# Altium project SINDiB_MM.PrjPcb (part 1 of 2)
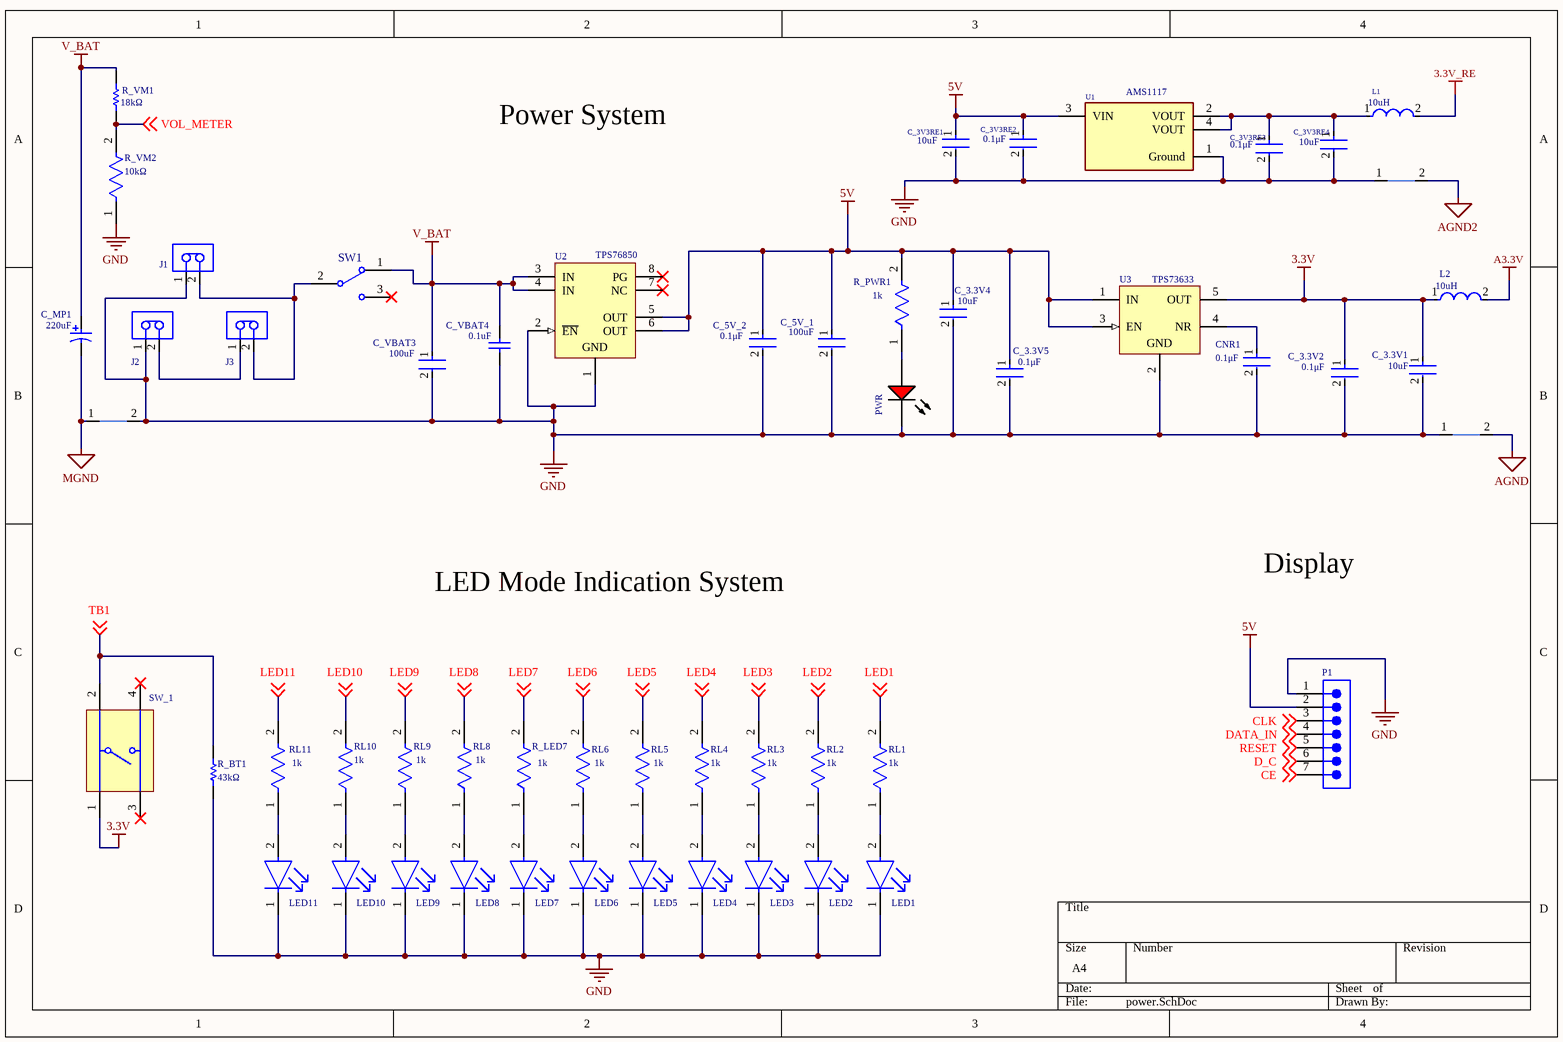
[diagram p0: power.SchDoc]
4 sheets, 150 parts. Net scope: global (net labels, ports and power ports of the same name join across sheets).
Board file: main_MM.PcbDoc
Sheets:
  power.SchDoc
  sensors.SchDoc
  main_controller.SchDoc
  motor.SchDoc

## Sheet power.SchDoc
size A4; SheetNumber: 1; SheetTotal: 4

### Parts
C_3.3V1  value 10uF  [FP-C0805C-DG-MFG]  (hidden comment: C0805C106K8PACTU)
C_3.3V2  value 0.1μF  [FP-C0805C-DN-MFG]  (hidden comment: C0805C104J8RACTU)
C_3.3V4  value 10uF  [FP-C0805C-DG-MFG]  (hidden comment: C0805C106K8PACTU)
C_3.3V5  value 0.1μF  [FP-C0805C-DN-MFG]  (hidden comment: C0805C104J8RACTU)
C_3V3RE1  value 10uF  [FP-C0805C-DG-MFG]  (hidden comment: C0805C106K8PACTU)
C_3V3RE2  value 0.1μF  [FP-C0805C-DN-MFG]  (hidden comment: C0805C104J8RACTU)
C_3V3RE3  value 0.1μF  [FP-C0805C-DN-MFG]  (hidden comment: C0805C104J8RACTU)
C_3V3RE4  value 10uF  [FP-C0805C-DG-MFG]  (hidden comment: C0805C106K8PACTU)
C_5V_1  value 100uF  [FP-C1206C-EH-MFG]  (hidden comment: C1206C107M9PACTU)
C_5V_2  value 0.1μF  [FP-C0805C-DN-MFG]  (hidden comment: C0805C104J8RACTU)
C_MP1  value 220uF  [NIC-CAPA2-6.3X7.7_V]  (hidden comment: UUD1A221MCL1GS)
C_VBAT3  value 100uF  [FP-C1206C-EH-MFG]  (hidden comment: C1206C107M9PACTU)
C_VBAT4  value 0.1uF  [CAPC2013X145X50LL20T25]  (hidden comment: C0805C105K4PACTU)
CNR1  value 0.1μF  [FP-C0805C-DN-MFG]  (hidden comment: C0805C104J8RACTU)
J1  B2B-PH-K-S(LF)(SN)  [JST-B2B-PH-K-S_V]  (value not drawn)
J2  B2B-PH-K-S(LF)(SN)  [JST-B2B-PH-K-S_V]  (value not drawn)
J3  B2B-PH-K-S(LF)(SN)  [JST-B2B-PH-K-S_V]  (value not drawn)
L1  value 10uH  [FP-LB2012-1_25-0_2-MFG]  (hidden comment: LBR2012T100K)
L2  value 10uH  [FP-LB2012-1_25-0_2-MFG]  (hidden comment: LBR2012T100K)
LED1  SML-D12M1WT86  [FP-SML-D12-MFG]  (value not drawn)
LED2  SML-D12M1WT86  [FP-SML-D12-MFG]  (value not drawn)
LED3  SML-D12M1WT86  [FP-SML-D12-MFG]  (value not drawn)
LED4  SML-D12M1WT86  [FP-SML-D12-MFG]  (value not drawn)
LED5  SML-D12M1WT86  [FP-SML-D12-MFG]  (value not drawn)
LED6  SML-D12M1WT86  [FP-SML-D12-MFG]  (value not drawn)
LED7  SML-D12M1WT86  [FP-SML-D12-MFG]  (value not drawn)
LED8  SML-D12M1WT86  [FP-SML-D12-MFG]  (value not drawn)
LED9  SML-D12M1WT86  [FP-SML-D12-MFG]  (value not drawn)
LED10  SML-D12M1WT86  [FP-SML-D12-MFG]  (value not drawn)
LED11  SML-D12M1WT86  [FP-SML-D12-MFG]  (value not drawn)
NT1  NT  [NETTIE_SMD]  (value not drawn)  (net tie, no BOM)
NT2  NT  [NETTIE_SMD]  (value not drawn)  (net tie, no BOM)
NT3  NT  [NETTIE_SMD]  (value not drawn)  (net tie, no BOM)
P1  61300711121  [61300711121]  (value not drawn)
PWR  TLMS1100-GS08  [VISH-TLMX1100_V]  (value not drawn)
R_BT1  value 43kΩ  [RESC1608X55X30NL20T20]  (hidden comment: ERA3AEB433V)
R_LED7  value 1k  [FP-RC0603-0_55-IPC_C]  (hidden comment: RC0603FR-071KL)
R_PWR1  value 1k  [FP-RC0603-0_55-IPC_C]  (hidden comment: RC0603FR-071KL)
R_VM1  value 18kΩ  [RESC1608X55X30ML15T15]  (hidden comment: ERJ-3EKF2002V)
R_VM2  value 10kΩ  [FP-ERA3A-IPC_C]  (hidden comment: ERA-3AEB103V)
RL1  value 1k  [FP-RC0603-0_55-IPC_C]  (hidden comment: RC0603FR-071KL)
RL2  value 1k  [FP-RC0603-0_55-IPC_C]  (hidden comment: RC0603FR-071KL)
RL3  value 1k  [FP-RC0603-0_55-IPC_C]  (hidden comment: RC0603FR-071KL)
RL4  value 1k  [FP-RC0603-0_55-IPC_C]  (hidden comment: RC0603FR-071KL)
RL5  value 1k  [FP-RC0603-0_55-IPC_C]  (hidden comment: RC0603FR-071KL)
RL6  value 1k  [FP-RC0603-0_55-IPC_C]  (hidden comment: RC0603FR-071KL)
RL8  value 1k  [FP-RC0603-0_55-IPC_C]  (hidden comment: RC0603FR-071KL)
RL9  value 1k  [FP-RC0603-0_55-IPC_C]  (hidden comment: RC0603FR-071KL)
RL10  value 1k  [FP-RC0603-0_55-IPC_C]  (hidden comment: RC0603FR-071KL)
RL11  value 1k  [FP-RC0603-0_55-IPC_C]  (hidden comment: RC0603FR-071KL)
SW1  EG1218  [ESWI-EG1218_V]  (value not drawn)
SW_1  1825910-6  [TECO-1825910-6_V]  (value not drawn)
U1  value AMS1117  [FP-AMS1117-IPC_C]  (hidden comment: AMS1117-3.3)
U2  value TPS76850  [D0008A_N]  (hidden comment: TPS76850QDR)
U3  value TPS73633  [DBV0005A_L]  (hidden comment: TPS73633DBVR)

### Nets
3.3V: C_3.3V1.1 C_3.3V2.1 L2.1 SW_1.1 U3.5(OUT)
3.3V_RE: L1.2
5V: C_3.3V4.1 C_3.3V5.1 C_3V3RE1.1 C_3V3RE2.1 C_5V_1.1 C_5V_2.1 P1.2 R_PWR1.2 U1.3(VIN) U2.5(OUT) U2.6(OUT) U3.1(IN) U3.3(EN)
A3.3V: L2.2
AGND: NT2.2
AGND2: NT3.2
GND: C_3.3V1.2 C_3.3V2.2 C_3.3V4.2 C_3.3V5.2 C_3V3RE1.2 C_3V3RE2.2 C_3V3RE3.2 C_3V3RE4.2 C_5V_1.2 C_5V_2.2 C_VBAT3.2 C_VBAT4.1 CNR1.2 J1.1 J2.1 LED1.1(C) LED2.1(C) LED3.1(C) LED4.1(C) LED5.1(C) LED6.1(C) LED7.1(C) LED8.1(C) LED9.1(C) LED10.1(C) LED11.1(C) NT1.2 NT2.1 NT3.1 P1.1 PWR.2(K) R_BT1.1 R_VM2.1 U1.1(Ground) U2.1(GND) U2.2(~{EN}) U3.2(GND)
MGND: C_MP1.2 NT1.1
V_BAT: C_MP1.1 C_VBAT3.1 C_VBAT4.2 R_VM1.2 SW1.1 U2.3(IN) U2.4(IN)
CE: P1.7 ; off-sheet CE
CLK: P1.3 ; off-sheet CLK
D_C: P1.6 ; off-sheet D_C
DATA_IN: P1.4 ; off-sheet DATA_IN
LED1: RL1.2 ; off-sheet LED1
LED2: RL2.2 ; off-sheet LED2
LED3: RL3.2 ; off-sheet LED3
LED4: RL4.2 ; off-sheet LED4
LED5: RL5.2 ; off-sheet LED5
LED6: RL6.2 ; off-sheet LED6
LED7: R_LED7.2 ; off-sheet LED7
LED8: RL8.2 ; off-sheet LED8
LED9: RL9.2 ; off-sheet LED9
LED10: RL10.2 ; off-sheet LED10
LED11: RL11.2 ; off-sheet LED11
RESET: P1.5 ; off-sheet RESET
TB1: R_BT1.2 SW_1.2 ; off-sheet TB1
VOL_METER: R_VM1.1 R_VM2.2 ; off-sheet VOL_METER
NetC_3V3RE3_1: C_3V3RE3.1 C_3V3RE4.1 L1.1 U1.2(VOUT) U1.4(VOUT)
NetCNR1_1: CNR1.1 U3.4(NR)
NetJ1_2: J1.2 J3.2 SW1.2(COM)
NetJ2_2: J2.2 J3.1
NetLED1_2: LED1.2(A) RL1.1
NetLED2_2: LED2.2(A) RL2.1
NetLED3_2: LED3.2(A) RL3.1
NetLED4_2: LED4.2(A) RL4.1
NetLED5_2: LED5.2(A) RL5.1
NetLED6_2: LED6.2(A) RL6.1
NetLED7_2: LED7.2(A) R_LED7.1
NetLED8_2: LED8.2(A) RL8.1
NetLED9_2: LED9.2(A) RL9.1
NetLED10_2: LED10.2(A) RL10.1
NetLED11_2: LED11.2(A) RL11.1
NetPWR_1: PWR.1(A) R_PWR1.1

Not connected (* = marked no-connect by the designer): SW1 3*; SW_1 3* 4*; U2 7(NC)* 8(PG)*

### Notes on the sheet
- Power System
- Display
- LED Mode Indication System

### Library data of the parts
C_3.3V1 C_3.3V4 C_3V3RE1 C_3V3RE4 = CMP-2007-03243-2: CAP CER 10UF 10V X5R 0805; Manufacturer: Kemet; 3DS Part Number: 220-00001; Tolerance: 10%; Temperature Coefficient: 15%; Device Class L2: Capacitors; Device Class L1: Passive Components; ComponentLink2URL: https://content.kemet.com/datasheets/KEM_C1006_X5R_SMD.pdf; Height: 1.4mm; Lead Free: Yes; Manufacturer Part Number: C0805C106K8PACTU; Digikey Description: CAP CER 10UF 10V X5R 0805; Octopart: https://octopart.com/c0805c106k8pactu-kemet-98697; Capacitance: 10uF; Temperature Range Low: -55°C; Temperature: -55°C to +85°C; Automotive: No; Mouser Description: CAP CER 10UF 10V X5R 0805; Ipc Land Pattern Name: CAPC200125X125; Material: Ceramic; Temperature Range High: +85°C; Voltage: 10V; RoHS: TRUE; Device Class L3: Ceramic Capacitors; ComponentLink2Description: Datasheet; Voltage Rating: 10V; Package: C0805C-DG; Temperature Characteristic: X5R; Category: Cap
C_3.3V2 C_3.3V5 C_3V3RE2 C_3V3RE3 C_5V_2 CNR1 = CMP-03020-032188-1: CAP CER 0.1UF 10V 5% X7R 0805; Manufacturer: KEMET; Tolerance: 0.05; Capacitance: 0.10 μF; Temperature Coefficient: 30ppm/°C; Package: C0805C-DN; Device Class L1: Passive Components; Temperature: -55°C to +125°C; Category: Cap; RoHS: TRUE; Mouser Description: Multilayer Ceramic Capacitors MLCC - SMD/SMT 10volts 0.1uF X7R 5%; Lead Free: Yes; Temperature Range Low: -55°C; Material: Ceramic; Temperature Range High: +125°C; Device Class L2: Capacitors; Temperature Characteristic: X7R; Device Class L3: Ceramic Capacitors; ComponentLink2Description: Datasheet; Automotive: No; Ipc Land Pattern Name: CAPC200125X78; Manufacturer Part Number: C0805C104J8RACTU; Voltage Rating: 10 V; Height: 0.88mm; Digikey Description: CAP CER 0.1UF 10V 5% X7R 0805; Octopart: https://octopart.com/c0805c104j8ractu-kemet-11807087; ComponentLink2URL: https://content.kemet.com/datasheets/KEM_C1003_C0G_SMD.pdf
C_5V_1 C_VBAT3 = CMP-1037-05005-3: CAP CER 100UF 6.3V X5R 1206; Dielectric Material: Ceramic; Tolerance: 2%; Dissipation Factor: 5%; Min Operating Temperature: -55°C; Case Code (Imperial): 1206; Case Code (Metric): 3216; Depth: 1.6mm; Dielectric: X5R; Max Operating Temperature: 85°C; Packaging: Tape and Reel; Construction: Flat; Series: C; Case/Package: 1206; Radiation Hardening: No; Voltage Rating (DC): 6.3V; Termination: SMD/SMT; Voltage Rating: 6.3V; Capacitance: 100uF; Number of Pins: 2; RoHS Compliant: Yes; Height: 1.6mm; Lead Free: Lead Free; Voltage: 6.3V; REACH SVHC: No SVHC; Length: 3.2mm; Mount: Surface Mount; Package Quantity: 1; Thickness: 0.071inch; Width: 0.063inch
C_MP1 = CMP-0687-00055-1: Aluminum Electrolytic Capacitor, UD Series, Low Impedance, 220 uF, 10 V, + / - 20%, -55 to 105 degC, Chip Type, 6.3 x 7.7 mm D x L, Pb-Free, Reel; Manufacturer: Nichicon; Packing: Dia382mm Reel; Tolerance Rated Capacitance: -20 to 20%; Impedance: 0.34 Ohm; Rated Ripple Current (at 100kHz): 280 mA; Rated Voltage: 10 V; Rated Capacitance: 220 uF; Endurance Time: 2000 h; RoHS: TRUE; ComponentLink1URL: http://www.nichicon.co.jp/; ComponentLink2Description: Datasheet; ComponentLink2URL: http://products.nichicon.co.jp/en/pdf/XJA043/e-ud.pdf; Mounting Technology: Surface Mount; PartNumber: UUD1A221MCL1GS; DatasheetVersion: 08/2012; ComponentLink3URL: http://products.nichicon.co.jp/en/pdf/XJA043/e-ud.pdf; ComponentLink3Description: Package Specification; PackageReference: CAPAE-D6.3H7.7; Diameter: 6.3 mm; PackageDescription: 2-Pin Surface Mount Device, Diameter 6.3 mm, Height 7.7 mm, Pitch 5.4 mm; Length: 7.7 mm; ComponentLink1Description: Manufacturer URL
C_VBAT4 = CMP-1036-04746-2: Manufacturer: Kemet; Part Number: C0805C105K4PACTU
J1-J3 = CMP-2000-05162-1: Male Header, Pitch 2 mm, 1 x 2 Position, Height 6 mm, Tail Length 3.4 mm, -25 to 85 degC, RoHS, Bulk; Manufacturer: JST; Pitch: 2mm; Style/Orientation: StraightHeader/Plug; No of Positions: 2; Datasheet Version: Nov-08; Datasheet URL: http://datasheet.octopart.com/B2B-PH-K-S%28LF%29%28SN%29-JST-datasheet-8324864.pdf; Manufacturer URL: http://www.jst.com/home2.html; Type: ShroudedHeader; Termination: Crimp
L1 L2 = CMP-14484-000421-1: SMD Inductors 10uH ±10% 0.15A 0.468Ω 0805; DC Current: 150mA; Core Material: Ferrite; Shielding: Unshielded; Test Frequency: 2.52MHz; DC Resistance (DCR): 360mR; Self Resonant Frequency: 32MHz; Military Standard: Not; Termination: SMD/SMT; Height - Seated (Max): 0.057inch; Current Rating: 150mA; Tolerance: 10%; Case Code (Imperial): 0805; Radiation Hardening: No; Inductance: 10uH; Resistor Type: Wirewound; Length: 0.079inch; Weight: 0.000194oz; Case Code (Metric): 2012; Max Operating Temperature: 105°C; Height: 1.6mm; Packaging: Tape and Reel; Lead Pitch: 1mm; Case/Package: 0805; Depth: 1.45mm; Series: LB; Mount: Surface Mount; Min Operating Temperature: -40°C; Inductance Tolerance: 10%; RoHS Compliant: Yes; Max DC Current: 150mA; Package Quantity: 3000; Lead Free: Lead Free; Width: 1.6mm; Halogen Free: Halogen Free
LED1-LED11 = CMP-08952-000005-1: LED YLW/GREEN DIFFUSED 1608 SMD; Manufacturer: Rohm; Led Orientation: Top View; Forward Voltage: 2.2V; Power Dissipation: 54mW; Wavelength: 572nm; Colour: Green; Reverse Voltage: 5V; Forward Current: 20mA; Luminous Intensity: 30mcd; Manufacturer Part Number: SML-D12M1WT86; RoHS: TRUE; Package: SML-D12; Temperature Range Low: -40°C; Device Class L3: unset; Temperature Range High: +85°C; Device Class L2: LEDs; Category: Diode; Device Class L1: Optoelectronics; Digikey Description: LED YLW/GREEN DIFFUSED 1608 SMD; Temperature: -40°C to +85°C; ComponentLink2Description: Datasheet; Automotive: No; Height: 0.65mm; Lead Free: Yes; Octopart: https://octopart.com/sml-d12m1wt86-rohm-70837112; ComponentLink2URL: https://www.rohm.com/datasheet/SML-D12M1W
NT1-NT3 = NetTie_SMD: Net Tie; type: NetI
P1 = CMP-1502-01074-2: NexarPartId: 32855531; Pitch: 2.54mm; Connector Type: Male Pin; Gender: Male; Current Rating: 3A; Contact Resistance: 20mΩ; Operating Supply Voltage: 250V; Number of Contacts: 7; REACH SVHC: Unknown; Termination: Solder; Contact Plating: Gold; Lead Pitch: 2.54mm; Contact Mating Length: 5.9944mm; RoHS: Compliant; Packaging: Bulk; Mount: Through Hole; Color: Black; Number of Pins: 7; Contact Material: Copper; Number of Rows: 1; Orientation: Vertical; Number of Positions: 7
PWR = CMP-1666-00027-1: LED, RED, 2.1 V, -40 to 100 degC, 2-Pin SMD (0603), RoHS, Tape and Reel; Type (Capacitors): C0G; Resistance: 100000000000 Ohm; Capacitance: 12 pF; Voltage Rating: 50 V; Tolerance: 5%; Min Operating Temperature: -55degC; REACH SVHC: No SVHC; ComponentLink2Description: Datasheet; ComponentLink1URL: http://www.vishay.com/; Width: 0.8 mm; Package Quantity: 4000; PackageReference: TLMX1100; ComponentLink2URL: http://www.vishay.com/docs/83173/tlmb1100.pdf; Case/Package: 0603; Case Code (Metric): 1608; Packaging: Tape and Reel; Pins: 2; ComponentLink1Description: Manufacturer URL; Max Operating Temperature: 125degC; Height: 0.8 mm; Length: 1.6 mm; Mount: Surface Mount; PackageDescription: 2-Pin Surface Mount Device, Body 1.6 x 0.8 mm; DatasheetVersion: Rev. 2.7, 03/2016; Case Code (Imperial): 0603; Voltage Rating (DC): 50 V; RoHSCompliant: True; Radiation Hardening: No
R_BT1 = CMP-2000-00064-1: Manufacturer: Panasonic; Part Number: ERA3AEB433V; Resistance: 43kΩ
R_LED7 R_PWR1 RL1-RL6 RL8-RL11 = CMP-1659-00009-5: RES 1K OHM 1% 1/10W 0603; Resistance: 1kR; Voltage Rating: 50V; Power Rating: 100mW; Temperature Coefficient: 100ppm/°C; Military Standard: Not; REACH SVHC: No SVHC; Size Code: 0603; Features: Moisture Resistant; Number of Terminations: 2; Technology: THICK FILM; Series: RC; Case Code (Metric): 1608; Resistance Tolerance: 1%; Resistor Type: Thick Film; Termination: SMD/SMT; Contact Plating: Tin; Radiation Hardening: No; Min Operating Temperature: -55°C; Max Operating Temperature: 155°C; Packaging: Tape and Reel; Max Power Dissipation: 100mW; RoHS Compliant: Yes; Height: 0.45mm; Lead Free: Lead Free; Case/Package: 0603; Length: 1.6mm; Tolerance: 1%; Case Code (Imperial): 0603; Construction: Rectangular; Depth: 0.8mm
R_VM1 = CMP-2000-00318-1: Manufacturer: Panasonic; Resistor: 20kΩ; Part Number: ERJ-3EKF2002V
R_VM2 = CMP-2000-00874-2: RES SMD 10K OHM 0.1% 1/10W 0603; Voltage Rating (DC): 75V; Power Rating: 100mW; Resistance: 10kR; Temperature Coefficient: 25ppm/°C; Radiation Hardening: No; Width: 0.8mm; Depth: 0.8mm; Construction: Rectangular; Case Code (Metric): 1608; Package Quantity: 5000; Length: 1.6mm; Size Code: 0603; Case Code (Imperial): 0603; Termination: SMD/SMT; Contact Plating: Tin; Resistance Tolerance: 0.1%; Military Standard: Not; Packaging: Tape and Reel; Max Power Dissipation: 100mW; REACH SVHC: No SVHC; Series: ERA-3A; Voltage Rating: 75V; Lead Free: Lead Free; Technology: METAL FILM; RoHS Compliant: Yes; Max Operating Temperature: 155°C; Resistor Type: Thin Film; Min Operating Temperature: -55°C; Number of Pins: 2; Case/Package: 0603; Tolerance: 0.1%; Height: 0.45mm; Mount: Surface Mount; Number of Terminations: 2
SW1 = CMP-1696-00002-1: Slide Switch, 500 V, -20 to 70 degC, 3-Pin THD, RoHS; Case\Package: SOT-23-5; Output Current: 150 mA; Nominal Output Voltage: 3.3 V; Max Power Dissipation: 250 mW; Min Input Voltage: 4.3 V; Outputs: 1; Max Input Voltage: 8 V; Dropout Voltage: 300 mV; PackageDescription: 3-Pin Through Hole Device, Body 11.6 x 4 mm, Pitch 2.5 mm; ComponentLink1URL: http://www.e-switch.ch/en/; RoHSCompliant: true; Length: 3 mm; ComponentLink1Description: Manufacturer URL; Power Rating: 250 mW; Mount: Surface Mount; Max Operating Temperature: 85 degC; REACH SVHC: No SVHC; Radiation Hardening: No; Height: 1.3 mm; Pins: 5; Max Ouput Current: 150 mA; Output Voltage: 3.3 V; Width: 1.8 mm; Package Quantity: 3000; ComponentLink2URL: https://www.e-switch.com/system/asset/product_line/data_sheet/119/EG.pdf; Min Operating Temperature: -40 degC; ComponentLink2Description: Datasheet; DatasheetVersion: Oct-15; PackageReference: EG1218; Packaging: Tape and Reel
SW_1 = CMP-1684-00021-1: Tact Switch, SPST-NO, 0.05 A, -35 to 85 degC, 4-Pin THD, RoHS, Bulk; Manufacturer: TE Connectivity; Maximum Contact Resistance: 100mOhm; Mechanical Life: 100000Cycles; Bushing Type: Unthreaded; Switch Configuration: OFF(ON); Maximum DC Voltage Rating: 24V; Contact Rating @ Voltage: 0.05A@24VDC; Actuator Color: Black; Body Orientation: Straight; Function: MomentaryContact; Illumination: N/R; Actuator Style: RoundButton; Actuator Material: PolybutyleneTerephthalate; Dielectric Strength: 500VAC; Pole Throw Configuration: SPST; Actuator Length: 1.4mm; Product Weight: N/A; Contact Material: CopperAlloy; Housing Material: N/A; Terminal Type: PCPins; Minimum Insulation Resistance: 100MOhm; Package Description: 4-Pin Through Hole Device, Body 5.99 x 5.99 mm, Pitch 6.5 mm; Part No: 1825910-6; Package Reference: THD; Base Material: N/A; Manufacturer URL: http://www.te.com; Contact Plating: Silver; RoHS: Yes; Datasheet Version: Rev. C9; Electrical Life: 100000Cycles; Maximum AC Voltage Rating: N/A; Thread Size: N/R; Operating Temperature: -35to85C; Mounting: ThroughHole; Dimension: 5.99x5mm; Datasheet URL: http://www.te.com/commerce/DocumentDelivery/DDEController?Action=showdoc&DocId=Customer+Drawing%7F1825910%7FC9%7Fpdf%7FEnglish%7FENG_CD_1825910_C9.pdf%7F1825910-6; Family: 1825910; Seal Location: N/A; Seal Description: N/A; Packaging: N/A
U1 = CMP-209535-000001-1: LDO Voltage Regulators 1A, 3.3V; Manufacturer: Advanced Monolithic Systems; Dropout Voltage: 1.1V; Output Type: Fixed; Nominal Supply Current: 5mA; Max Power Dissipation: 1.2W; Max Supply Voltage: 15V; Number Of Outputs: 1; Standoff Height: 0.64mm; Max Junction Temp: +125°C; Height: 1.8mm; Package: AMS1117; Device Class L2: Power Management ICs; ComponentLink2Description: Datasheet; ComponentLink2URL: http://www.advanced-monolithic.com/pdf/ds1117.pdf; Category: IC; RoHS: TRUE; Automotive: No; Device Class L1: Integrated Circuits (ICs); Output Current: 1A; Device Class L3: Voltage Regulators - Linear; Temperature: -40°C to +125°C; Output Voltage: 3.3V; Manufacturer Part Number: AMS1117-3.3; Temperature Range Low: -40°C; Octopart: https://octopart.com/ams1117-3.3-advanced+monolithic+systems-25899300; Lead Free: Yes; Ipc Land Pattern Name: SOT229P700X180-4; Temperature Range High: +125°C
U2 = CMP-0395-00088-2: Single Output Fast Transient Response LDO, 1 A, Fixed 5 V Output, 2.7 to 10 V Input, with Low IQ, 8-pin SOIC (D), -40 to 125 degC, Green (RoHS & no Sb/Br); Manufacturer: Texas Instruments; Iout(Max)(A): 1; Vout Adj(Max)(V): 5; Power Good: TRUE; Vin(Max)(V): 10; Accuracy(%): 2; Vdo(Typ)(mV): 230; Iq(Typ)(mA): 0.08; Vin(Min)(V): 2.7; SubFamily: Single Channel LDO; PackageDescription: 8-Pin Plastic Small Outline, Body 4.9 x 3.9 mm, Pitch 1.27 mm; Mounting Technology: Surface Mount; DatasheetVersion: SLVS211L; Eco-Plan: Green (RoHS & no Sb/Br); ComponentLink1Description: Manufacturer URL; ComponentLink1URL: http://www.ti.com/; PackageVersion: 4040047-3/M; ComponentLink3Description: Package Specification; PartNumber: TPS76850QDR; ComponentLink2Description: Datasheet; PackageReference: D0008A; ComponentLink3URL: http://www.ti.com/litv/pdf/msoi002j; Vout Adj(Min)(V): 5; ComponentLink2URL: http://www.ti.com/general/docs/lit/getliterature.tsp?genericPartNumber=TPS76850&fileType=pdf; Code_JEDEC: MS-012; Fixed Output Options(V): 5
U3 = CMP-0395-00256-2: Single Output Low Noise LDO, 400 mA, Fixed 3.3 V Output, 1.7 to 5.5 V Input, with Reverse Current Protection, 5-pin SOT-23 (DBV), -40 to 85 degC, Green (RoHS & no Sb/Br); Manufacturer: Texas Instruments; Vin(Min)(V): 1.7; Vdo(Typ)(mV): 75; Iq(Typ)(mA): 0.3; SubFamily: Single Channel LDO; Vout Adj(Max)(V): 3.3; Accuracy(%): 1; Vin(Max)(V): 5.5; Iout(Max)(A): 0.4; Rating: Catalog; ComponentLink1Description: Manufacturer URL; PartNumber: TPS73633DBVR; PackageDescription: 5-Pin Plastic Small Outline, Body 1.60 Ãƒâ€” 2.90 mm, Pitch 0.95 mm; ComponentLink3URL: http://www.ti.com/litv/pdf/mpds018i; ComponentLink2Description: Datasheet; ComponentLink4Description: URL Link1; DatasheetVersion: SBVS038T; Vout Adj(Min)(V): 3.3; Code_JEDEC: MO-178; Fixed Output Options(V): 3.3; Eco-Plan: Green (RoHS & no Sb/Br); PackageReference: DBV0005A; ComponentLink4URL: Samples URL:http://www.ti.com/product/tps73633#samples; PackageVersion: 4073253-4/K; ComponentLink2URL: http://www.ti.com/general/docs/lit/getliterature.tsp?genericPartNumber=TPS73633&fileType=pdf; ComponentLink1URL: http://www.ti.com/; ComponentLink3Description: Package Specification; Mounting Technology: Surface Mount

## Sheet sensors.SchDoc
size A4; SheetNumber: 2; SheetTotal: 4
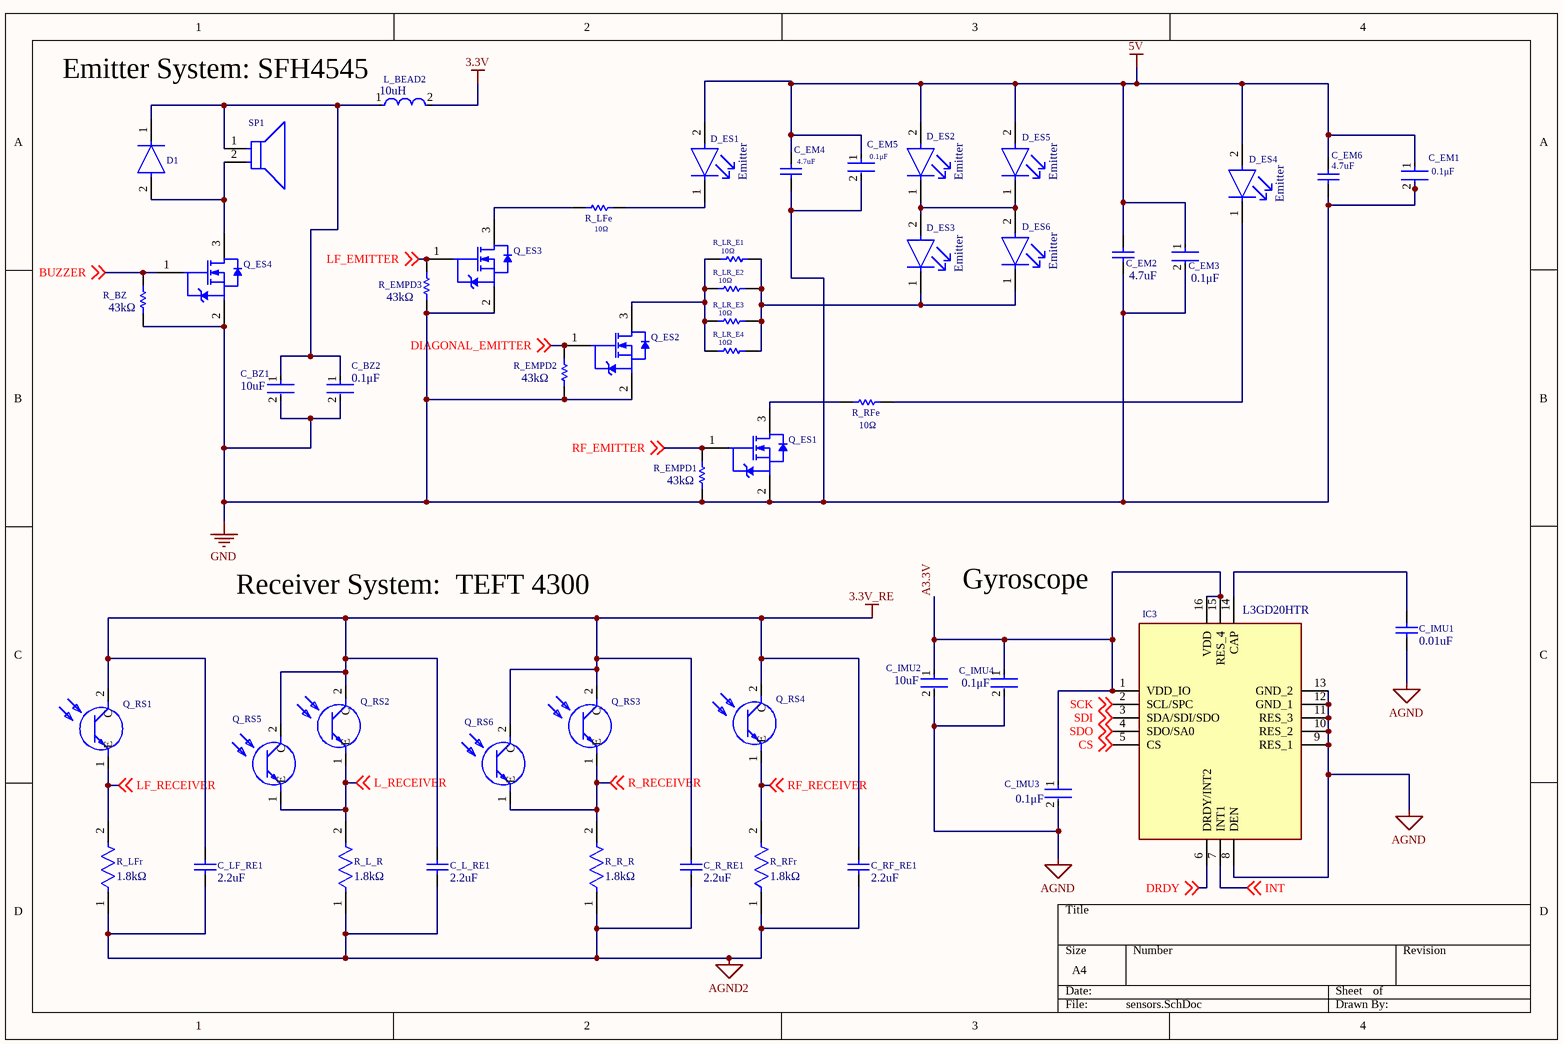
[diagram p1: sensors.SchDoc]

### Parts
C_BZ1  value 10uF  [FP-C0805C-DG-MFG]  (hidden comment: C0805C106K8PACTU)
C_BZ2  value 0.1μF  [FP-C0805C-DN-MFG]  (hidden comment: C0805C104J8RACTU)
C_EM1  value 0.1μF  [FP-C0805C-DN-MFG]  (hidden comment: C0805C104J8RACTU)
C_EM2  value 4.7uF  [CAPC2013X145X50NL20T25]  (hidden comment: C0805C475M3PACTU)
C_EM3  value 0.1μF  [FP-C0805C-DN-MFG]  (hidden comment: C0805C104J8RACTU)
C_EM4  value 4.7uF  [CAPC2013X145X50NL20T25]  (hidden comment: C0805C475M3PACTU)
C_EM5  value 0.1μF  [FP-C0805C-DN-MFG]  (hidden comment: C0805C104J8RACTU)
C_EM6  value 4.7uF  [CAPC2013X145X50NL20T25]  (hidden comment: C0805C475M3PACTU)
C_IMU1  value 0.01uF  [CAPC2013X88X50LL20T25]  (hidden comment: C0805C103K5RACTU)
C_IMU2  value 10uF  [FP-C0805C-DG-MFG]  (hidden comment: C0805C106K8PACTU)
C_IMU3  value 0.1μF  [FP-C0805C-DN-MFG]  (hidden comment: C0805C104J8RACTU)
C_IMU4  value 0.1μF  [FP-C0805C-DN-MFG]  (hidden comment: C0805C104J8RACTU)
C_L_RE1  value 2.2uF  [CAPC2013X145X50ML20T25]  (hidden comment: C0805C225K9PACTU)
C_LF_RE1  value 2.2uF  [CAPC2013X145X50ML20T25]  (hidden comment: C0805C225K9PACTU)
C_R_RE1  value 2.2uF  [CAPC2013X145X50ML20T25]  (hidden comment: C0805C225K9PACTU)
C_RF_RE1  value 2.2uF  [CAPC2013X145X50ML20T25]  (hidden comment: C0805C225K9PACTU)
D1  1N4148W-TP  [FP-SOD-123-IPC_A]  (value not drawn)
D_ES1  Emitter  [FP-SFH_4556-MFG]
D_ES2  Emitter  [FP-SFH_4556-MFG]
D_ES3  Emitter  [FP-SFH_4556-MFG]
D_ES4  Emitter  [FP-SFH_4556-MFG]
D_ES5  Emitter  [FP-SFH_4556-MFG]
D_ES6  Emitter  [FP-SFH_4556-MFG]
IC3  L3GD20HTR  [H3LIS100DLTR]
L_BEAD2  value 10uH  [FP-LB2012-1_25-0_2-MFG]  (hidden comment: LBR2012T100K)
Q_ES1  FDV303N  [FAIR-FDV303N-3_V]  (value not drawn)
Q_ES2  FDV303N  [FAIR-FDV303N-3_V]  (value not drawn)
Q_ES3  FDV303N  [FAIR-FDV303N-3_V]  (value not drawn)
Q_ES4  FDV303N  [FAIR-FDV303N-3_V]  (value not drawn)
Q_RS1  TEFT4300  [TEFT4300]  (value not drawn)
Q_RS2  TEFT4300  [TEFT4300]  (value not drawn)
Q_RS3  TEFT4300  [TEFT4300]  (value not drawn)
Q_RS4  TEFT4300  [TEFT4300]  (value not drawn)
Q_RS5  TEFT4300  [TEFT4300]  (value not drawn)
Q_RS6  TEFT4300  [TEFT4300]  (value not drawn)
R_BZ  value 43kΩ  [RESC1608X55X30NL20T20]  (hidden comment: ERA3AEB433V)
R_EMPD1  value 43kΩ  [RESC1608X55X30NL20T20]  (hidden comment: ERA3AEB433V)
R_EMPD2  value 43kΩ  [RESC1608X55X30NL20T20]  (hidden comment: ERA3AEB433V)
R_EMPD3  value 43kΩ  [RESC1608X55X30NL20T20]  (hidden comment: ERA3AEB433V)
R_L_R  value 1.8kΩ  [FP-RN732A-MFG]  (hidden comment: Y11721K80000T0R)
R_LFe  value 10Ω  [RESC2013X70X40NL20T20]  (hidden comment: ERJ-6ENF10R0V)
R_LFr  value 1.8kΩ  [FP-RN732A-MFG]  (hidden comment: Y11721K80000T0R)
R_LR_E1  value 10Ω  [RESC2013X70X40NL20T20]  (hidden comment: ERJ-6ENF10R0V)
R_LR_E2  value 10Ω  [RESC2013X70X40NL20T20]  (hidden comment: ERJ-6ENF10R0V)
R_LR_E3  value 10Ω  [RESC2013X70X40NL20T20]  (hidden comment: ERJ-6ENF10R0V)
R_LR_E4  value 10Ω  [RESC2013X70X40NL20T20]  (hidden comment: ERJ-6ENF10R0V)
R_R_R  value 1.8kΩ  [FP-RN732A-MFG]  (hidden comment: Y11721K80000T0R)
R_RFe  value 10Ω  [RESC2013X70X40NL20T20]  (hidden comment: ERJ-6ENF10R0V)
R_RFr  value 1.8kΩ  [FP-RN732A-MFG]  (hidden comment: Y11721K80000T0R)
SP1  AI-1223-TWT-3V-2-R  [FP-AI-1223-TWT-3V-2-R-MFG]  (value not drawn)

### Nets
3.3V: L_BEAD2.2
3.3V_RE: C_L_RE1.2 C_LF_RE1.2 C_R_RE1.2 C_RF_RE1.2 Q_RS1.2(C) Q_RS2.2(C) Q_RS3.2(C) Q_RS4.2(C) Q_RS5.2(C) Q_RS6.2(C)
5V: C_EM1.1 C_EM2.2 C_EM3.1 C_EM4.2 C_EM5.1 C_EM6.2 D_ES1.2(A) D_ES2.2(A) D_ES4.2(A) D_ES5.2(A)
A3.3V: C_IMU2.1 C_IMU3.1 C_IMU4.1 IC3.1(VDD_IO) IC3.15(RES_4) IC3.16(VDD)
AGND: C_IMU1.1 C_IMU2.2 C_IMU3.2 C_IMU4.2 IC3.8(DEN) IC3.9(RES_1) IC3.10(RES_2) IC3.11(RES_3) IC3.12(GND_1) IC3.13(GND_2)
AGND2: C_L_RE1.1 C_LF_RE1.1 C_R_RE1.1 R_L_R.1 R_LFr.1 R_R_R.1 R_RFr.1
GND: C_BZ1.2 C_BZ2.2 C_EM1.2 C_EM2.1 C_EM3.2 C_EM4.1 C_EM5.2 C_EM6.1 Q_ES1.2(S) Q_ES2.2(S) Q_ES3.2(S) Q_ES4.2(S) R_BZ.1 R_EMPD1.1 R_EMPD2.1 R_EMPD3.1
BUZZER: Q_ES4.1(G) R_BZ.2 ; off-sheet BUZZER
CS: IC3.5(CS) ; off-sheet CS
DIAGONAL_EMITTER: Q_ES2.1(G) R_EMPD2.2 ; off-sheet DIAGONAL_EMITTER
DRDY: IC3.6(DRDY/INT2) ; off-sheet DRDY
INT: IC3.7(INT1) ; off-sheet INT
L_RECEIVER: Q_RS2.1(E) Q_RS5.1(E) R_L_R.2 ; off-sheet L_RECEIVER
LF_EMITTER: Q_ES3.1(G) R_EMPD3.2 ; off-sheet LF_EMITTER
LF_RECEIVER: Q_RS1.1(E) R_LFr.2 ; off-sheet LF_RECEIVER
R_RECEIVER: Q_RS3.1(E) Q_RS6.1(E) R_R_R.2 ; off-sheet R_RECEIVER
RF_EMITTER: Q_ES1.1(G) R_EMPD1.2 ; off-sheet RF_EMITTER
RF_RECEIVER: Q_RS4.1(E) R_RFr.2 ; off-sheet RF_RECEIVER
SCK: IC3.2(SCL/SPC) ; off-sheet SCK
SDI: IC3.3(SDA/SDI/SDO) ; off-sheet SDI
SDO: IC3.4(SDO/SA0) ; off-sheet SDO
NetC_BZ1_1: C_BZ1.1 C_BZ2.1 D1.1(C) L_BEAD2.1 SP1.1(C)
NetC_IMU1_2: C_IMU1.2 IC3.14(CAP)
NetD1_2: D1.2(A) Q_ES4.3(D) SP1.2(A)
NetD_ES1_1: D_ES1.1(C) R_LFe.2
NetD_ES2_1: D_ES2.1(C) D_ES3.2(A) D_ES5.1(C) D_ES6.2(A)
NetD_ES3_1: D_ES3.1(C) D_ES6.1(C) R_LR_E1.2 R_LR_E2.2 R_LR_E3.2 R_LR_E4.2
NetD_ES4_1: D_ES4.1(C) R_RFe.2
NetQ_ES1_3: Q_ES1.3(D) R_RFe.1
NetQ_ES2_3: Q_ES2.3(D) R_LR_E1.1 R_LR_E2.1 R_LR_E3.1 R_LR_E4.1
NetQ_ES3_3: Q_ES3.3(D) R_LFe.1

Not connected (* = marked no-connect by the designer): C_RF_RE1 1

### Notes on the sheet
- (near L_BEAD2) Emitter System: SFH4545
- Gyroscope
- Receiver System:  TEFT 4300

### Library data of the parts
C_BZ1 C_IMU2 = CMP-2007-03243-2: as C_3.3V1 on sheet power; Device Class L2: Capacitors; Device Class L1: Passive Components; ComponentLink2URL: https://content.kemet.com/datasheets/KEM_C1006_X5R_SMD.pdf; Height: 1.4mm; Lead Free: Yes; Manufacturer Part Number: C0805C106K8PACTU; Digikey Description: CAP CER 10UF 10V X5R 0805; Octopart: https://octopart.com/c0805c106k8pactu-kemet-98697; Capacitance: 10uF; Temperature Range Low: -55°C; Temperature: -55°C to +85°C; Automotive: No; Mouser Description: CAP CER 10UF 10V X5R 0805; Ipc Land Pattern Name: CAPC200125X125; Material: Ceramic; Temperature Range High: +85°C; Voltage: 10V; RoHS: TRUE; Device Class L3: Ceramic Capacitors; ComponentLink2Description: Datasheet; Voltage Rating: 10V; Package: C0805C-DG; Temperature Characteristic: X5R; Category: Cap
C_BZ2 C_EM1 C_EM3 C_EM5 C_IMU3 C_IMU4 = CMP-03020-032188-1: as C_3.3V2 on sheet power; Package: C0805C-DN; Device Class L1: Passive Components; Temperature: -55°C to +125°C; Category: Cap; RoHS: TRUE; Mouser Description: Multilayer Ceramic Capacitors MLCC - SMD/SMT 10volts 0.1uF X7R 5%; Lead Free: Yes; Temperature Range Low: -55°C; Material: Ceramic; Temperature Range High: +125°C; Device Class L2: Capacitors; Temperature Characteristic: X7R; Device Class L3: Ceramic Capacitors; ComponentLink2Description: Datasheet; Automotive: No; Ipc Land Pattern Name: CAPC200125X78; Manufacturer Part Number: C0805C104J8RACTU; Voltage Rating: 10 V; Height: 0.88mm; Digikey Description: CAP CER 0.1UF 10V 5% X7R 0805; Octopart: https://octopart.com/c0805c104j8ractu-kemet-11807087; ComponentLink2URL: https://content.kemet.com/datasheets/KEM_C1003_C0G_SMD.pdf
C_EM2 C_EM4 C_EM6 = CMP-2007-01014-1: Manufacturer: Kemet; Part Number: C0805C475M3PACTU; Capacitance: 4.7uF
C_IMU1 = CMP-2007-00266-1: Manufacturer: Kemet; Part Number: C0805C103K5RACTU; Capacitance: 0.01uF
C_L_RE1 C_LF_RE1 C_R_RE1 C_RF_RE1 = CMP-1036-04819-2: Manufacturer: Kemet; Part Number: C0805C225K9PACTU
D1 = CMP-2000-04993-2: DIODE GEN PURP 100V 150MA SOD123; Max Reverse Leakage Current: 5uA; Max Surge Current: 2A; Reverse Recovery Time: 4ns; Polarity: Standard; Capacitance: 4pF; Max Forward Surge Current (Ifsm): 1A; Element Configuration: Single; Power Dissipation: 400mW; Forward Voltage: 1V; Radiation Hardening: No; Lead Free: Lead Free; Max Reverse Voltage (DC): 100V; Current Rating: 150mA; Forward Current: 150mA; Packaging: Tape and Reel; Number of Pins: 2; Package Quantity: 3000; Max Operating Temperature: 150°C; Min Operating Temperature: -65°C; Average Rectified Current: 150mA; Recovery Time: 4ns; Output Current: 150mA; Peak Non-Repetitive Surge Current: 2A; Width: 1.8mm; Voltage Rating (DC): 100V; Height: 1.2mm; Max Repetitive Reverse Voltage (Vrrm): 100V; Mount: Surface Mount; Length: 2.85mm; Value: 1N4148W
D_ES1-D_ES6 = CMP-62016-000017-1: EMITTER IR 950NM 100MA RADIAL; Manufacturer: Osram Opto; Viewing Angle: 10°; Reverse Voltage: 12V; Led Orientation: Straight; Forward Voltage: 1.5V; Automotive: No; ComponentLink2URL: https://dammedia.osram.info/media/resource/hires/osram-dam-2496340/SFH%204556.pdf; Temperature: -40°C to +100°C; Device Class L1: Optoelectronics; Colour: Infrared; RoHS: TRUE; Manufacturer Part Number: SFH 4545; Peak Emmision Wavelength: 950nm; Temperature Range Low: -40°C; Device Class L2: LEDs; Package: SFH 4545; ComponentLink2Description: Datasheet; Device Class L3: unset; Digikey Description: EMITTER IR 950NM 100MA RADIAL; Forward Current: 100mA; Mouser Description: SFH 4556 Osram Opto, 860nm IR LED, 5mm (T-1 3/4) Through Hole package; Lead Free: Yes; Temperature Range High: +100°C; Category: Diode
IC3 = L3GD20HTR: Integrated Circuit; Manufacturer_Name: STMicroelectronics; Datasheet Link: http://www.st.com/content/ccc/resource/technical/document/datasheet/35/b1/e0/39/71/57/43/01/DM00060659.pdf/files/DM00060659.pdf/jcr:content/translations/en.DM00060659.pdf; Height: 1mm; Manufacturer_Part_Number: L3GD20HTR; Mouser Part Number: 511-L3GD20HTR; Mouser Price/Stock: https://www.mouser.co.uk/ProductDetail/STMicroelectronics/L3GD20HTR?qs=7v3IMFVTeKNoM%2F2Sb4QSlQ%3D%3D; Arrow Part Number: L3GD20HTR; Arrow Price/Stock: https://www.arrow.com/en/products/l3gd20htr/stmicroelectronics
L_BEAD2 = CMP-14484-000421-1: as L1 on sheet power; Military Standard: Not; Termination: SMD/SMT; Height - Seated (Max): 0.057inch; Current Rating: 150mA; Tolerance: 10%; Case Code (Imperial): 0805; Radiation Hardening: No; Inductance: 10uH; Resistor Type: Wirewound; Length: 0.079inch; Weight: 0.000194oz; Case Code (Metric): 2012; Max Operating Temperature: 105°C; Height: 1.6mm; Packaging: Tape and Reel; Lead Pitch: 1mm; Case/Package: 0805; Depth: 1.45mm; Series: LB; Mount: Surface Mount; Min Operating Temperature: -40°C; Inductance Tolerance: 10%; RoHS Compliant: Yes; Max DC Current: 150mA; Package Quantity: 3000; Lead Free: Lead Free; Width: 1.6mm; Halogen Free: Halogen Free
Q_ES1-Q_ES4 = CMP-2000-05111-1: N-Channel MOSFET Transistor, 8 V VGSS, 25 V VDSS, 0.68 A, -55 to 150 degC, 3-Pin SOT23, RoHS, Tape and Reel; Manufacturer: Fairchild; Typical Turn-On Delay Time: 3ns; Channel Mode: Enhancement; RDS-on: 450@4.5VmOhm; Maximum Continuous Drain Current: 0.68A; Maximum Drain Source Voltage: 25V; Rad Hard: No; Typical Fall Time: 13ns; Channel Type: N; Typical Turn-Off Delay Time: 17ns; Maximum Gate Source Voltage: 8V; Typical Rise Time: 8.5ns; Mounting: SurfaceMount; Packaging: Tape&Reel; Manufacturer URL: https://www.fairchildsemi.com/; Datasheet URL: https://datasheet.ciiva.com/22681/1845307-22681736.pdf; Package: 3SOT-23; Category: MOSFET; Operating Temperature: -55to150degC; Datasheet Version: Rev. D2, 07/2014
Q_RS1-Q_RS6 = TEFT4300: Phototransistor; Manufacturer_Name: Vishay; Datasheet Link: https://datasheet.datasheetarchive.com/originals/distributors/Datasheets-310/86913.pdf; Height: 6.1mm; Manufacturer_Part_Number: TEFT4300; Mouser Part Number: 782-TEFT4300; Mouser Price/Stock: https://www.mouser.co.uk/ProductDetail/Vishay-Semiconductors/TEFT4300?qs=HsFHTXumnCRbcrt8oPFPMA%3D%3D; Arrow Part Number: TEFT4300; Arrow Price/Stock: https://www.arrow.com/en/products/teft4300/vishay?region=nac
R_BZ R_EMPD1-R_EMPD3 = CMP-2000-00064-1: Manufacturer: Panasonic; Part Number: ERA3AEB433V; Resistance: 43kΩ
R_L_R R_LFr R_R_R R_RFr = CMP-03211-001802-1: SMD Chip Resistor, Thin Film, 1.8KΩ, 100 V, 0805 [2012 Metric], 100 mW, 0.1%, RN73 Series; Manufacturer Part Number: RN73C2A1K91BTDF; Manufacturer: TE Connectivity; Power Rating: 0.1W; Temperature Coefficient: 10ppm/°C; Voltage Rating: 100V; Automotive: No; Lead Free: Yes; Device Class L1: Passive Components; Device Class L2: Resistors; Category: Res; Resistance: 1.8kΩ; Temperature Range High: 155°C; packaging: 1000 Reel; Octopart: https://octopart.com/rn73c2a1k91btdf-te+connectivity-42431691; octopart_url: https://octopart.com/rn73c2a1k91btdf-te+connectivity-42431691; Package: RN732A; Temperature: -55°C to 155°C; Composition: Thin Film; RoHS: TRUE; Ipc Land Pattern Name: RESC200125X55; ComponentLink2Description: Datasheet; Height: 0.65mm; Tolerance: 0.1%; Series: RN73; Device Class L3: Chip SMD Resistors; Temperature Range Low: -55°C; ComponentLink2URL: https://www.te.com/commerce/DocumentDelivery/DDEController?Action=showdoc&DocId=Data+Sheet%7F1773270%7FP%7Fpdf%7FEnglish%7FENG_DS_1773270_P.pdf%7F1676162-2
R_LFe R_LR_E1-R_LR_E4 R_RFe = CMP-1013-00284-2: Manufacturer: Panasonic; Part Number: ERJ-6ENF10R0V; Resistance: 10Ω
SP1 = CMP-103888-000003-1: BUZZER MAGNETIC 3V 12MM TH; Min Supply Voltage (DC): 2V; Operating Supply Current: 30mA; Max Supply Voltage (DC): 4V; Input Type: DC; Frequency: 2.3kHz; Series: AI; Nominal Supply Voltage (DC): 3V; Packaging: Tray; Max Operating Temperature: 70°C; Height: 7.5mm; Termination: PC Pins; Max Supply Current: 30mA; Mount: Through Hole; Diameter: 12mm; Voltage Rating: 3V; Sensing Method: Magnetic; Min Operating Temperature: -20°C; Contact Plating: Tin

## Sheet main_controller.SchDoc
size A4; SheetNumber: 3; SheetTotal: 4
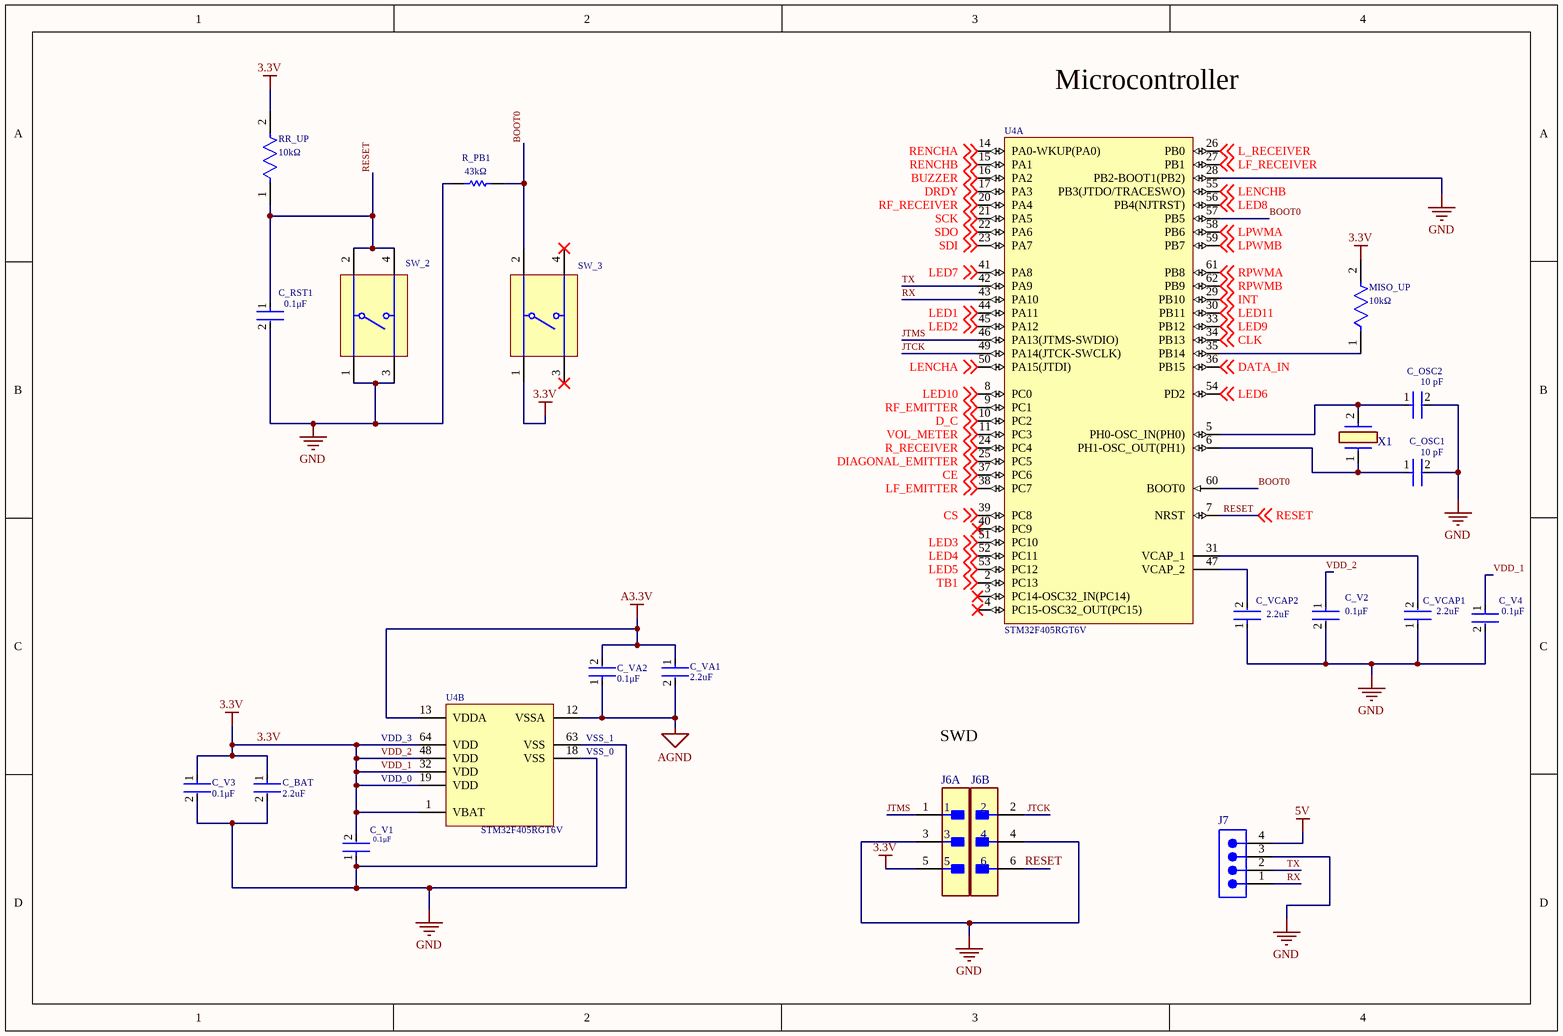
[diagram p2: main_controller.SchDoc]

### Parts
C_BAT  Capacitance: 2.2uF  [FP-C2012-125-0_2-IPC_C]  (hidden comment: C2012X5R1H225K125AB)
C_OSC1  value 10 pF  [FP-C0805C-DN-MFG]  (hidden comment: C0805C100K5GACTU)
C_OSC2  value 10 pF  [FP-C0805C-DN-MFG]  (hidden comment: C0805C100K5GACTU)
C_RST1  value 0.1μF  [FP-C0805C-DN-MFG]  (hidden comment: C0805C104J8RACTU)
C_V1  value 0.1μF  [FP-C0805C-DN-MFG]  (hidden comment: C0805C104J8RACTU)
C_V2  value 0.1μF  [FP-C0805C-DN-MFG]  (hidden comment: C0805C104J8RACTU)
C_V3  value 0.1μF  [FP-C0805C-DN-MFG]  (hidden comment: C0805C104J8RACTU)
C_V4  value 0.1μF  [FP-C0805C-DN-MFG]  (hidden comment: C0805C104J8RACTU)
C_VA1  Capacitance: 2.2uF  [FP-C2012-125-0_2-IPC_C]  (hidden comment: C2012X5R1H225K125AB)
C_VA2  value 0.1μF  [FP-C0805C-DN-MFG]  (hidden comment: C0805C104J8RACTU)
C_VCAP1  Capacitance: 2.2uF  [FP-C2012-125-0_2-IPC_C]  (hidden comment: C2012X5R1H225K125AB)
C_VCAP2  Capacitance: 2.2uF  [FP-C2012-125-0_2-IPC_C]  (hidden comment: C2012X5R1H225K125AB)
J6  90131-0763  [FP-90131-0763-MFG]  (value not drawn)  (parts A,B of 2)
J7  61300411121  [61300411121]  (value not drawn)
MISO_UP  value 10kΩ  [FP-ERA3A-IPC_C]  (hidden comment: ERA-3AEB103V)
R_PB1  value 43kΩ  [RESC1608X55X30NL20T20]  (hidden comment: ERA3AEB433V)
RR_UP  value 10kΩ  [FP-ERA3A-IPC_C]  (hidden comment: ERA-3AEB103V)
SW_2  1825910-6  [TECO-1825910-6_V]  (value not drawn)
SW_3  1825910-6  [TECO-1825910-6_V]  (value not drawn)
U4  STM32F405RGT6V  [STM-LQFP64_V]  (parts A,B of 2)
X1  NX5032GA-16.000M-LN-CD-1  [NX5032GA16000000MHZLNCD1]  (value not drawn)

### Nets
3.3V: C_BAT.1 C_V1.2 C_V2.1 C_V3.1 C_V4.1 J6.5 MISO_UP.2 RR_UP.2 SW_3.1 U4.1(VBAT) U4.19(VDD) U4.32(VDD) U4.48(VDD) U4.64(VDD)  [also labelled VDD_1, VDD_2]
5V: J7.4
A3.3V: C_VA1.1 C_VA2.2 U4.13(VDDA)
AGND: C_VA1.2 C_VA2.1 U4.12(VSSA)
GND: C_BAT.2 C_OSC1.2 C_OSC2.2 C_RST1.2 C_V1.1 C_V2.2 C_V3.2 C_V4.2 C_VCAP1.1 C_VCAP2.1 J6.3 J6.4 J7.3 R_PB1.2 SW_2.1 SW_2.3 U4.18(VSS) U4.28(PB2-BOOT1(PB2)) U4.63(VSS)
BOOT0: R_PB1.1 SW_3.2 U4.57(PB5) U4.60(BOOT0)
BUZZER: U4.16(PA2) ; off-sheet BUZZER
CE: U4.37(PC6) ; off-sheet CE
CLK: U4.34(PB13) ; off-sheet CLK
CS: U4.39(PC8) ; off-sheet CS
D_C: U4.10(PC2) ; off-sheet D_C
DATA_IN: U4.36(PB15) ; off-sheet DATA_IN
DIAGONAL_EMITTER: U4.25(PC5) ; off-sheet DIAGONAL_EMITTER
DRDY: U4.17(PA3) ; off-sheet DRDY
INT: U4.29(PB10) ; off-sheet INT
JTCK: J6.2 U4.49(PA14(JTCK-SWCLK))
JTMS: J6.1 U4.46(PA13(JTMS-SWDIO))
L_RECEIVER: U4.26(PB0) ; off-sheet L_RECEIVER
LED1: U4.44(PA11) ; off-sheet LED1
LED2: U4.45(PA12) ; off-sheet LED2
LED3: U4.51(PC10) ; off-sheet LED3
LED4: U4.52(PC11) ; off-sheet LED4
LED5: U4.53(PC12) ; off-sheet LED5
LED6: U4.54(PD2) ; off-sheet LED6
LED7: U4.41(PA8) ; off-sheet LED7
LED8: U4.56(PB4(NJTRST)) ; off-sheet LED8
LED9: U4.33(PB12) ; off-sheet LED9
LED10: U4.8(PC0) ; off-sheet LED10
LED11: U4.30(PB11) ; off-sheet LED11
LENCHA: U4.50(PA15(JTDI)) ; off-sheet LENCHA
LENCHB: U4.55(PB3(JTDO/TRACESWO)) ; off-sheet LENCHB
LF_EMITTER: U4.38(PC7) ; off-sheet LF_EMITTER
LF_RECEIVER: U4.27(PB1) ; off-sheet LF_RECEIVER
LPWMA: U4.58(PB6) ; off-sheet LPWMA
LPWMB: U4.59(PB7) ; off-sheet LPWMB
R_RECEIVER: U4.24(PC4) ; off-sheet R_RECEIVER
RENCHA: U4.14(PA0-WKUP(PA0)) ; off-sheet RENCHA
RENCHB: U4.15(PA1) ; off-sheet RENCHB
RESET: C_RST1.1 J6.6 RR_UP.1 SW_2.2 SW_2.4 U4.7(NRST) ; off-sheet RESET
RF_EMITTER: U4.9(PC1) ; off-sheet RF_EMITTER
RF_RECEIVER: U4.20(PA4) ; off-sheet RF_RECEIVER
RPWMA: U4.61(PB8) ; off-sheet RPWMA
RPWMB: U4.62(PB9) ; off-sheet RPWMB
RX: J7.1 U4.43(PA10)
SCK: U4.21(PA5) ; off-sheet SCK
SDI: U4.23(PA7) ; off-sheet SDI
SDO: U4.22(PA6) ; off-sheet SDO
TB1: U4.2(PC13) ; off-sheet TB1
TX: J7.2 U4.42(PA9)
VOL_METER: U4.11(PC3) ; off-sheet VOL_METER
NetC_OSC1_1: C_OSC1.1 U4.6(PH1-OSC_OUT(PH1)) X1.1(X1)
NetC_OSC2_1: C_OSC2.1 U4.5(PH0-OSC_IN(PH0)) X1.2(X2)
NetC_VCAP1_2: C_VCAP1.2 U4.31(VCAP_1)
NetC_VCAP2_2: C_VCAP2.2 U4.47(VCAP_2)
NetMISO_UP_1: MISO_UP.1 U4.35(PB14)

Not connected (* = marked no-connect by the designer): SW_3 3* 4*; U4 3(PC14-OSC32_IN(PC14))* 4(PC15-OSC32_OUT(PC15))* 40(PC9)*

### Notes on the sheet
- Microcontroller
- VDD_0
- (near U4) VDD_3
- (near U4) VSS_0
- (near U4) VSS_1
- SWD

### Library data of the parts
C_BAT C_VA1 C_VCAP1 C_VCAP2 = CMP-08246-005698-1: Multilayer Ceramic Capacitors 2.2μF ±10% 50V X5R SMD 0805; Insulation Resistance: 10GR; Dissipation Factor: 5%; Width: 1.2mm; Packaging: Tape and Reel; REACH SVHC: No SVHC; Dielectric: X5R; Dielectric Material: Ceramic; Voltage Rating: 50V; Radiation Hardening: No; Height: 1.25mm; Termination: SMD/SMT; Max Operating Temperature: 85°C; Resistor Type: Ceramic; Package Quantity: 1; Min Operating Temperature: -55°C; Weight: 0.000194oz; Thickness: 0.057inch; Lead Free: Lead Free; Tolerance: 10%; Voltage Rating (DC): 50V; RoHS Compliant: Yes; Construction: Flat; Mount: Surface Mount; Depth: 1.25mm; Length: 2mm; Case Code (Imperial): 0805; Case/Package: 0805; Series: C; Case Code (Metric): 2012
C_OSC1 C_OSC2 = CMP-2007-00462-2: CAP CER 10PF 50V 10% NP0 0805; Manufacturer: KEMET; Temperature Characteristic: C0G; Temperature Coefficient: 30ppm/°C; Tolerance: 0.1; Package: C0805C-DN; Device Class L2: Capacitors; Mouser Description: Multilayer Ceramic Capacitors MLCC - SMD/SMT 50volts 10pF C0G 10%; ComponentLink2URL: https://content.kemet.com/datasheets/KEM_C1003_C0G_SMD.pdf; Automotive: No; Device Class L3: Ceramic Capacitors; Temperature: -55°C to +125°C; Manufacturer Part Number: C0805C100K5GACTU; Digikey Description: CAP CER 10PF 50V 10% NP0 0805; Material: Ceramic; RoHS: TRUE; Temperature Range High: +125°C; Capacitance: 10 pF; Category: Cap; Voltage Rating: 50 V; Octopart: https://octopart.com/c0805c100k5gactu-kemet-8089747; Height: 0.88mm; Lead Free: Yes; Ipc Land Pattern Name: CAPC200125X78; Temperature Range Low: -55°C; Device Class L1: Passive Components; ComponentLink2Description: Datasheet
C_RST1 C_V1-C_V4 C_VA2 = CMP-03020-032188-1: as C_3.3V2 on sheet power; Package: C0805C-DN; Device Class L1: Passive Components; Temperature: -55°C to +125°C; Category: Cap; RoHS: TRUE; Mouser Description: Multilayer Ceramic Capacitors MLCC - SMD/SMT 10volts 0.1uF X7R 5%; Lead Free: Yes; Temperature Range Low: -55°C; Material: Ceramic; Temperature Range High: +125°C; Device Class L2: Capacitors; Temperature Characteristic: X7R; Device Class L3: Ceramic Capacitors; ComponentLink2Description: Datasheet; Automotive: No; Ipc Land Pattern Name: CAPC200125X78; Manufacturer Part Number: C0805C104J8RACTU; Voltage Rating: 10 V; Height: 0.88mm; Digikey Description: CAP CER 0.1UF 10V 5% X7R 0805; Octopart: https://octopart.com/c0805c104j8ractu-kemet-11807087; ComponentLink2URL: https://content.kemet.com/datasheets/KEM_C1003_C0G_SMD.pdf
J6 = CMP-00257-00655468-1: 90131-0763 Conn Unshrouded Header HDR 6 POS 2.54mm Solder ST Top Entry Thru-Hole C-Grid III™ Tray; NexarPartId: 655468; Manufacturer Lifecycle Status: ACTIVE; Number of Poles: 6; Plating: Tin; Current Rating: 3A; Gender: Male; Voltage Rating (AC): 350V; Contact Resistance: 20mΩ; Insulation Resistance: 5GΩ; Pitch: 2.54mm; Height: 9.65mm; Mount: Through Hole; Termination: Through Hole; Contact Plating: Gold; Orientation: Vertical; Material: Glass, Polyester; Min Operating Temperature: -55°C; Lead Free: Lead Free; REACH SVHC: Unknown; Contact Material: Brass; Housing Color: Black; Schedule B: 8536694040; Number of Rows: 2; Lead Pitch: 2.54mm; Number of Circuits: 6; Number of Positions: 6; Lifecycle Status: Production; Max Operating Temperature: 125°C; Voltage Rating: 350V; Voltage Rating (DC): 350V; Country of Origin: SG; Housing Material: Polyester; RoHS: Compliant; Working Voltage: 350V; Number of Contacts: 6; Radiation Hardening: No
J7 = CMP-1502-01064-2: NexarPartId: 32855522; Pitch: 2.54mm; Number of Contacts: 4; Contact Resistance: 20mΩ; Gender: Male; Current Rating: 3A; Connector Type: Male Pin; Voltage Rating: 250V; Lead Free: Lead Free; Contact Plating: Gold; Max Operating Temperature: 105°C; Packaging: Bulk; Height: 8.89mm; Orientation: Vertical; Contact Mating Length: 5.9944mm; Contact Material: Copper; Lead Pitch: 2.54mm; Min Operating Temperature: -40°C; Termination: Solder; Color: Black; Number of Rows: 1; REACH SVHC: Unknown; RoHS: Compliant; Mount: Through Hole; Number of Positions: 4; Number of Pins: 4; Operating Supply Voltage: 250V
MISO_UP RR_UP = CMP-2000-00874-2: as R_VM2 on sheet power; Radiation Hardening: No; Width: 0.8mm; Depth: 0.8mm; Construction: Rectangular; Case Code (Metric): 1608; Package Quantity: 5000; Length: 1.6mm; Size Code: 0603; Case Code (Imperial): 0603; Termination: SMD/SMT; Contact Plating: Tin; Resistance Tolerance: 0.1%; Military Standard: Not; Packaging: Tape and Reel; Max Power Dissipation: 100mW; REACH SVHC: No SVHC; Series: ERA-3A; Voltage Rating: 75V; Lead Free: Lead Free; Technology: METAL FILM; RoHS Compliant: Yes; Max Operating Temperature: 155°C; Resistor Type: Thin Film; Min Operating Temperature: -55°C; Number of Pins: 2; Case/Package: 0603; Tolerance: 0.1%; Height: 0.45mm; Mount: Surface Mount; Number of Terminations: 2
R_PB1 = CMP-2000-00064-1: Manufacturer: Panasonic; Part Number: ERA3AEB433V; Resistance: 43kΩ
SW_2 SW_3 = CMP-1684-00021-1: as SW_1 on sheet power; Product Weight: N/A; Contact Material: CopperAlloy; Housing Material: N/A; Terminal Type: PCPins; Minimum Insulation Resistance: 100MOhm; Package Description: 4-Pin Through Hole Device, Body 5.99 x 5.99 mm, Pitch 6.5 mm; Part No: 1825910-6; Package Reference: THD; Base Material: N/A; Manufacturer URL: http://www.te.com; Contact Plating: Silver; RoHS: Yes; Datasheet Version: Rev. C9; Electrical Life: 100000Cycles; Maximum AC Voltage Rating: N/A; Thread Size: N/R; Operating Temperature: -35to85C; Mounting: ThroughHole; Dimension: 5.99x5mm; Datasheet URL: http://www.te.com/commerce/DocumentDelivery/DDEController?Action=showdoc&DocId=Customer+Drawing%7F1825910%7FC9%7Fpdf%7FEnglish%7FENG_CD_1825910_C9.pdf%7F1825910-6; Family: 1825910; Seal Location: N/A; Seal Description: N/A; Packaging: N/A
U4 = CMP-0243-00092-2: ARM Cortex-M4 32-bit MCU+FPU, 210 DMIPS, 1024 kB Flash, 192 kB Internal RAM, 51 I/Os, 64-pin LQFP, -40 to 85 degC, Tray; Manufacturer: STMicroelectronics; FLASH Size (Prog) (kB): 1024; D/A Converter: 2x12-bit; Supply Voltage(Vcc) min (V): 1.8; Operating Frequency(F) (Processor speed) (MHz): 168; Internal RAM Size (kB): 192; Supply Voltage(Vcc) max (V): 3.6; I/Os (High Current): 51; ComponentLink2URL: http://www.st.com/st-web-ui/static/active/en/resource/technical/document/datasheet/DM00037051.pdf; ComponentLink3URL: http://www.st.com/st-web-ui/static/active/en/resource/technical/document/datasheet/DM00037051.pdf; Mounting Technology: Surface Mount; PackageReference: LQFP64; ComponentLink2Description: Datasheet; Core: ARM Cortex-M4; ComponentLink1Description: Manufacturer URL; ComponentLink1URL: http://www.st.com/web/en/home.html; PartNumber: STM32F405RGT6V; PackageVersion: Rev. 4, 06/2013; Packing: Tray; DatasheetVersion: Rev. 4; PackageDescription: 64-Pin Low Profile Quad Flat Package, 10 x 10 mm Body, 0.5 mm Pitch; ComponentLink3Description: Package Specification
X1 = NX5032GA-16.000M-LN-CD-1: Crystal or Oscillator; Manufacturer_Name: NDK; Datasheet Link: https://media.digikey.com/pdf/Data%20Sheets/NDK%20PDFs/NX5032GA.pdf; Height: 1.5mm; Manufacturer_Part_Number: NX5032GA-16.000M-LN-CD-1; Mouser Part Number: 344-NX5032GA16MLNCD1; Mouser Price/Stock: https://www.mouser.co.uk/ProductDetail/NDK/NX5032GA-16.000M-LN-CD-1?qs=55YtniHzbhDnyNixVDBwYw%3D%3D